# EAGLE design Sensor Breakout (EAGLE 9.6.2)
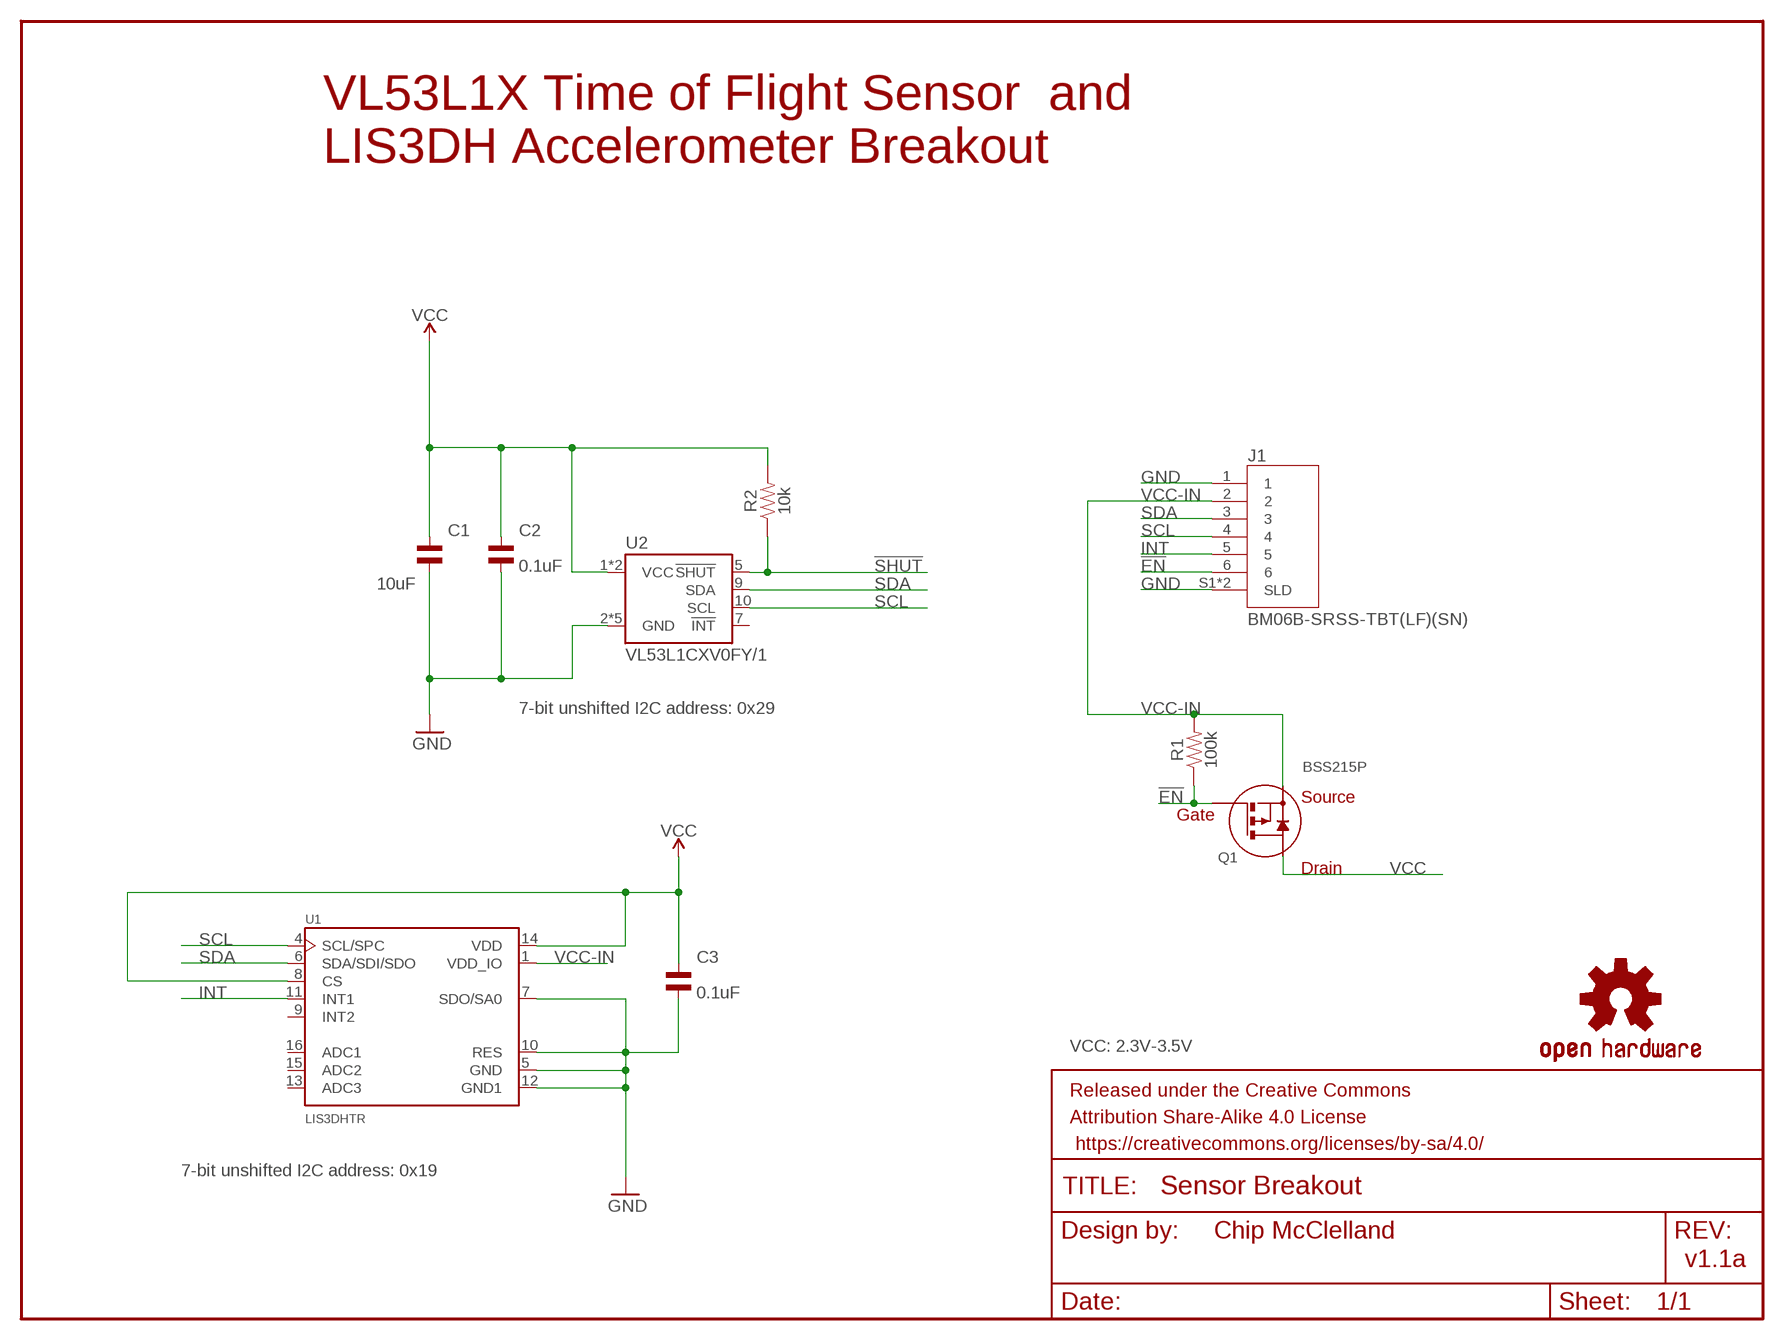
[diagram p0: schematic, sheet 1]

## Parts
C1  10uF  CAP-MF-10UF-1206  [C1206]
C2  0.1uF  CAP-MF-0.1UF-  [C0805]
C3  0.1uF  CAP-MF-0.1UF-  [C0805]
FRAME1  FRAME-LETTER  [CREATIVE_COMMONS]
J1  BM06B-SRSS-TBT(LF)(SN)  [JST_BM06B-SRSS-TB(LF)(SN)]
LOGO1  OSHW-LOGOMINI  [OSHW-LOGO-MINI]
Q1  BSS215P  [SOT-23_3L_ONS-M]
R1  100k  RESISTOR-MF-100K-0805  [0805]
R2  10k  RESISTOR-MF-10K-0805  [0805]
U1  LIS3DHTR  LIS3DH  [PQFN50P300X300X100-16N]
U2  VL53L1CXV0FY/1  VL53L1XSMD  [VL53L1X]

## Nets
!EN: J1.6 Q1.1(GATE) R1.1
!SHUT: R2.1 U2.5(!SHUT)
GND: C1.P$2 C2.P$2 C3.P$2 J1.1 J1.S1(SLD) J1.S2(SLD) U1.5(GND) U1.7(SDO/SA0) U1.10(RES) U1.12(GND1) U2.2(GND) U2.3(GND) U2.4(GND) U2.6(GND) U2.12(GND)
INT: J1.5 U1.11(INT1)
SCL: J1.4 U1.4(SCL/SPC) U2.10(SCL)
SDA: J1.3 U1.6(SDA/SDI/SDO) U2.9(SDA)
VCC: C1.P$1 C2.P$1 C3.P$1 Q1.3(DRAIN) R2.2 U1.8(CS) U1.14(VDD) U2.1(VCC) U2.11(VCC)
VCC-IN: J1.2 Q1.2(SOURCE) R1.2 U1.1(VDD_IO)
Unconnected: U1.9(INT2) U1.13(ADC3) U1.15(ADC2) U1.16(ADC1) U2.7(!INT)

## Notes on the sheet
- VL53L1X Time of Flight Sensor  and 
  LIS3DH Accelerometer Breakout
- 7-bit unshifted I2C address: 0x29
- VCC: 2.3V-3.5V
- 7-bit unshifted I2C address: 0x19
- Chip McClelland
- v1.1a

## Library data of the parts
C1 = Custom Components:CAP-MF-10UF-: Library: MF_Passives Description: Device for Non-Polarized Capacitors. Manufacture part number (MPN) can be added via Attributes. Check https://factory.macrofab.com/parts for the house parts list.; DIELECTRIC: X5R; HOUSEPART: Yes; MPN: MF-CAP-1206-10uF; POPULATE: 1; VOLTAGE: 16V
C2 C3 = Custom Components:CAP-MF-0.1UF-: Capacitor Macrofab House Part (https://factory.macrofab.com/parts). Standard ceramic capacitor, and 0.1" leaded capacitor.; DIELECTRIC: Y5V; HOUSEPART: YES; MPN: MF-CAP-0805-0.1uF; POPULATE: 1; VOLTAGE: 50V
FRAME1 = SparkFun-Aesthetics:FRAME-LETTER: Schematic Frame - Letter Standard 8.5x11 US Letter frame; POPULATE: 0
J1 = Custom Components:BM06B-SRSS-TBT(LF)(SN): 6 Position 1.0mm Top-Entry Surface Mount Shrouded Header; MPN: BM06B-SRSS-TBT(LF)(SN); POPULATE: 1
LOGO1 = SparkFun-Aesthetics:OSHW-LOGO: Open-Source Hardware (OSHW) Logo This logo indicates the piece of hardware it is found on incorporates a OSHW license and/or adheres to the definition of open source hardware found here: http://freedomdefined.org/OSHW; POPULATE: 0
Q1 = Custom Components:BSS215P; HOUSEPART: No; MPN: BSS215PH6327XTSA1; PKG: SOT-23; POPULATE: 1
R1 = Custom Components:RESISTOR-MF-100K-: Generic 0805 Resistor Package; MPN: MF-RES-0805-100K; POPULATE: 1; URL: https://factory.macrofab.com/part/MF-RES-0805-100K
R2 = Custom Components:RESISTOR-MF-10K-: Generic 0805 Resistor Package; MPN: MF-RES-0805-10K; POPULATE: 1; URL: https://factory.macrofab.com/part/MF-RES-0805-10K
U1 = Custom Components:LIS3DH: MEMS digital output motion sensor ultra low-power high performance 3-axes "nano" accelerometer Check availability <https://pricing.snapeda.com/parts/LIS3DH/STMicroelectronics/view-part?ref=eda>; AVAILABILITY: Not in stock; DESCRIPTION: Accelerometer X, Y, Z Axis ±2g, 4g, 8g, 16g 0.5Hz ~ 625Hz 16-LGA (3x3); MF: STMicroelectronics; MP: LIS3DH; PACKAGE: LGA-16 STMicroelectronics; PRICE: None
U2 = SparkFun-Sensors:VL53L1X: STMicroelectronics VL53L1X - 400 cm IR Laser ToF Sensor VL53L1X is a state-of-the-art ToF laser-ranging sensor, enhancing the ST FlightSense product family. It is the fastest miniature ToF sensor currently on the market with accurate ranging up to 4 m and fast ranging frequency (up to 50 Hz). Housed in a miniature and reflowable package, it integrates a single photon avalanche diode (SPAD) receiving array, a 940 nm invisible laser Class 1 emitter, physical infrared filters, and optics to achieve the best ranging performance in various ambient lighting conditions with a range of cover window options.; PROD_ID: IC-13960

## Net classes
0 default: width 0.203 mm, drill 0.33 mm
1 power: width 0.203 mm

## Board
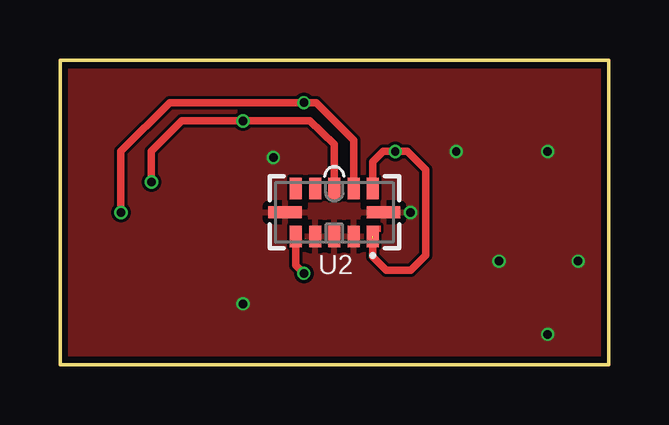
[diagram p1: board, top side]
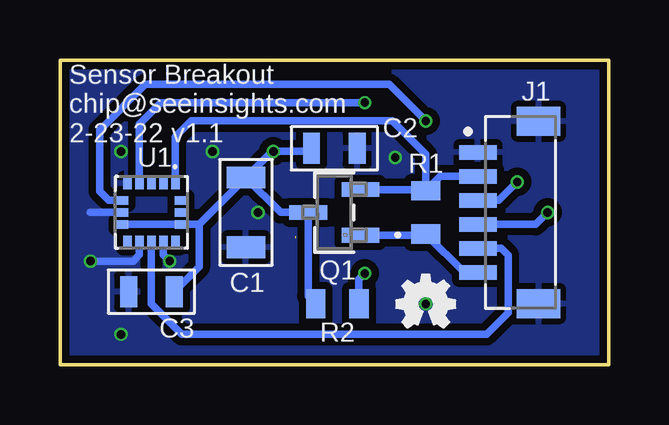
[diagram p2: board, bottom side, seen from below]

Size 22.86 x 12.7 mm. Coordinates in mm from the lower left corner, seen from the top.
Outline: 0,0 0,12.7 22.86,12.7 22.86,0 0,0
Copper layers (1*16): Top 0.035mm / dielectric 1.5mm / Bottom 0.035mm
Design rules "MF_Standard_2_Layer": minimum track width 5mil, minimum drill 10mil, track to track 5mil, track to pad 5mil, pad to pad 5mil, via to via 5mil, smd to smd 0mil, copper to edge 10mil, drill to drill 10mil, minimum pad ring 4mil, minimum via ring 4mil, stop-mask expansion 2mil, vias tented up to drill 25mil, thermal gap 10mil

### Footprints (pad centres in the part's own frame; a part is rotated, then mirrored left to right if it is on the bottom)
C1206 = smd 0.9 x 1.6: P$1 -1.45,0; P$2 1.45,0
C0805 = smd 0.7 x 1.3: P$1 -0.95,0; P$2 0.95,0
JST_BM06B-SRSS-TB(LF)(SN) = smd 0.6 x 1.55: 1 -2.5,-2.525; 2 -1.5,-2.525; 3 -0.5,-2.525; 4 0.5,-2.525; 5 1.5,-2.525; 6 2.5,-2.525 | smd 1.2 x 1.8: S1 -3.8,0; S2 3.8,0
SOT-23_3L_ONS-M = smd 0.61 x 1.575: 1 -0.953,-1.092; 2 0.953,-1.092; 3 0,1.092
0805 = smd 0.8 x 1.2: 1 -0.9,0; 2 0.9,0
PQFN50P300X300X100-16N = smd 0.52 x 0.35: 1 -1.225,1; 2 -1.225,0.5; 3 -1.225,0; 4 -1.225,-0.5; 5 -1.225,-1; 9 1.225,-1; 10 1.225,-0.5; 11 1.225,0; 12 1.225,0.5; 13 1.225,1 | smd 0.35 x 0.52: 6 -0.5,-1.225; 7 0,-1.225; 8 0.5,-1.225; 14 0.5,1.225; 15 0,1.225; 16 -0.5,1.225
VL53L1X = smd 0.5 x 0.9: 1 1.6,-1; 2 0.8,-1; 3 0,-1; 4 -0.8,-1; 5 -1.6,-1; 7 -1.6,1; 8 -0.8,1; 9 0,1; 10 0.8,1; 11 1.6,1 | smd 1.4 x 0.5: 6 -2.05,0; 12 2.05,0

### Placement (x,y rotation side)
C1  15.11,6.35 270 bottom
C2  11.43,9.02 0 bottom
C3  19.05,3.05 180 bottom
FRAME1  -15.24,-8.89 0 top  (outside the outline)
J1  2.92,6.35 270 bottom
LOGO1  7.62,2.54 0 bottom
Q1  11.43,6.35 90 bottom
R1  7.62,6.35 90 bottom
R2  11.3,2.54 180 bottom
U1  19.05,6.35 270 bottom
U2  11.43,6.35 0 top

### Tracks (layer width: path | path; a pad name or v marks a point on that pad's centre or on a via)
!EN
  Bottom 0.305: J1.6 6.02,3.85 R1.1 7.67,5.4 Q1.1
!SHUT  (via drill 0.35)
  Top 0.305: U2.5 9.83,4.14 v10.16,3.81
  Bottom 0.305: v10.16,3.81 10.4,3.57 R2.1
GND  (via drill 0.35)
  Bottom 0.305: U1.10 19.55,4.58 19.81,4.32 v21.59,4.32 | U1.12 18.55,4.58 v18.29,4.32 | U1.7 21.59,6.35
  other vias: 14.61,6.35 20.32,8.89 7.62,2.54 20.32,1.27 16.51,8.89 8.89,8.64
  pour Bottom (isolate 0.305): -1.27,-1.27 -1.27,13.97 24.13,13.97 24.13,-1.27
  pour Top (isolate 0.305): -3.81,-1.27 -3.81,24.13 26.67,24.13 26.67,-1.27
  pour Top: -1.27,16.51 24.13,16.51 24.13,-1.27 -1.27,-1.27
INT
  Bottom 0.305: U1.11 19.05,2.54 17.78,1.27 5.08,1.27 4.19,2.16 4.19,4.57 4.47,4.85 J1.5
SCL  (via drill 0.35)
  Top 0.305: U2.10 12.23,9.36 10.67,10.92 v10.16,10.92 4.57,10.92 2.54,8.89 v2.54,6.35
  Bottom 0.305: v2.54,6.35 3.04,5.85 J1.4 | U1.4 19.55,10.03 18.66,10.92 v10.16,10.92
SDA  (via drill 0.35)
  Top 0.305: U2.9 11.43,7.39 11.43,9.19 10.41,10.16 v7.62,10.16 5.08,10.16 3.81,8.89 v3.81,7.62
  Bottom 0.305: v3.81,7.62 4.58,6.85 J1.3 | U1.6 20.82,6.85 21.21,7.24 21.21,9.78 19.3,11.68 9.14,11.68 v7.62,10.16
VCC  (via drill 0.35)  (1 unrouted)
  Top 0.305: U2.11 13.03,8.46 13.46,8.89 v13.97,8.89 14.48,8.89 15.24,8.13 15.24,4.57 14.61,3.94 13.59,3.94 13.03,4.5 13.03,5.27
  Bottom 0.305: C1.P$1 13.66,6.35 Q1.3 12.52,2.86 R2.2 | C1.P$1 14,8.92 v13.97,8.89 12.51,8.89 C2.P$1 | C1.P$1 17.06,5.85 | 17.06,5.85 U1.14 U1.8 | C3.P$1 17.06,4.08 17.06,5.85
VCC-IN
  Bottom 0.305: J1.2 7.02,7.85 R1.2 | R1.2 7.67,7.3 Q1.2 | U1.1 18.05,9.51 17.4,10.16 9.02,10.16 7.62,8.76 R1.2

### Text on the board
bPlace: Sensor Breakout / chip@seeinsights.com / 2-23-22 v1.1
tDocu: Chip McClelland